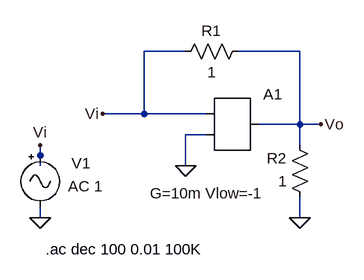
[diagram p0: schematic ej3d.asc]
ej3d.asc, the LTspice schematic file:
Version 4
SHEET 1 880 680
WIRE 144 48 80 48
WIRE 320 48 224 48
WIRE 80 144 80 48
WIRE 80 144 16 144
WIRE 176 144 80 144
WIRE 320 160 320 48
WIRE 320 160 256 160
WIRE 352 160 320 160
WIRE 176 176 144 176
WIRE 320 192 320 160
WIRE -80 208 -80 192
WIRE -80 224 -80 208
WIRE 144 224 144 176
WIRE -80 304 -80 288
WIRE 320 304 320 272
FLAG 144 224 0
FLAG 16 144 Vi
FLAG 352 160 Vo
FLAG 320 304 0
FLAG -80 192 Vi
FLAG -80 304 0
SYMBOL SpecialFunctions\\ota 208 96 R0
WINDOW 3 -119 170 Left 2
SYMATTR InstName A1
SYMATTR Value G=10m Vlow=-1
SYMBOL res 240 32 R90
WINDOW 0 0 56 VBottom 2
WINDOW 3 32 56 VTop 2
SYMATTR InstName R1
SYMATTR Value 1
SYMBOL res 336 288 R180
WINDOW 0 36 76 Left 2
WINDOW 3 36 40 Left 2
SYMATTR InstName R2
SYMATTR Value 1
SYMBOL Misc\\signal -80 192 R0
WINDOW 0 48 28 Left 2
WINDOW 123 43 63 Left 2
WINDOW 39 0 0 Left 0
SYMATTR InstName V1
SYMATTR Value ""
SYMATTR Value2 AC 1
TEXT -72 352 Left 2 !.ac dec 100 0.01 100K

The netlist it stands for:
* ej3d.asc
A1 Vi 0 0 0 0 0 Vo 0 OTA G=10m Vlow=-1
R1 Vo Vi 1
R2 0 Vo 1
V1 Vi 0 AC 1
.ac dec 100 0.01 100K
.backanno
.end